# EAGLE design Sparkfun_LilyPad-Switched-Battery_SVOP (EAGLE 7.5.0)
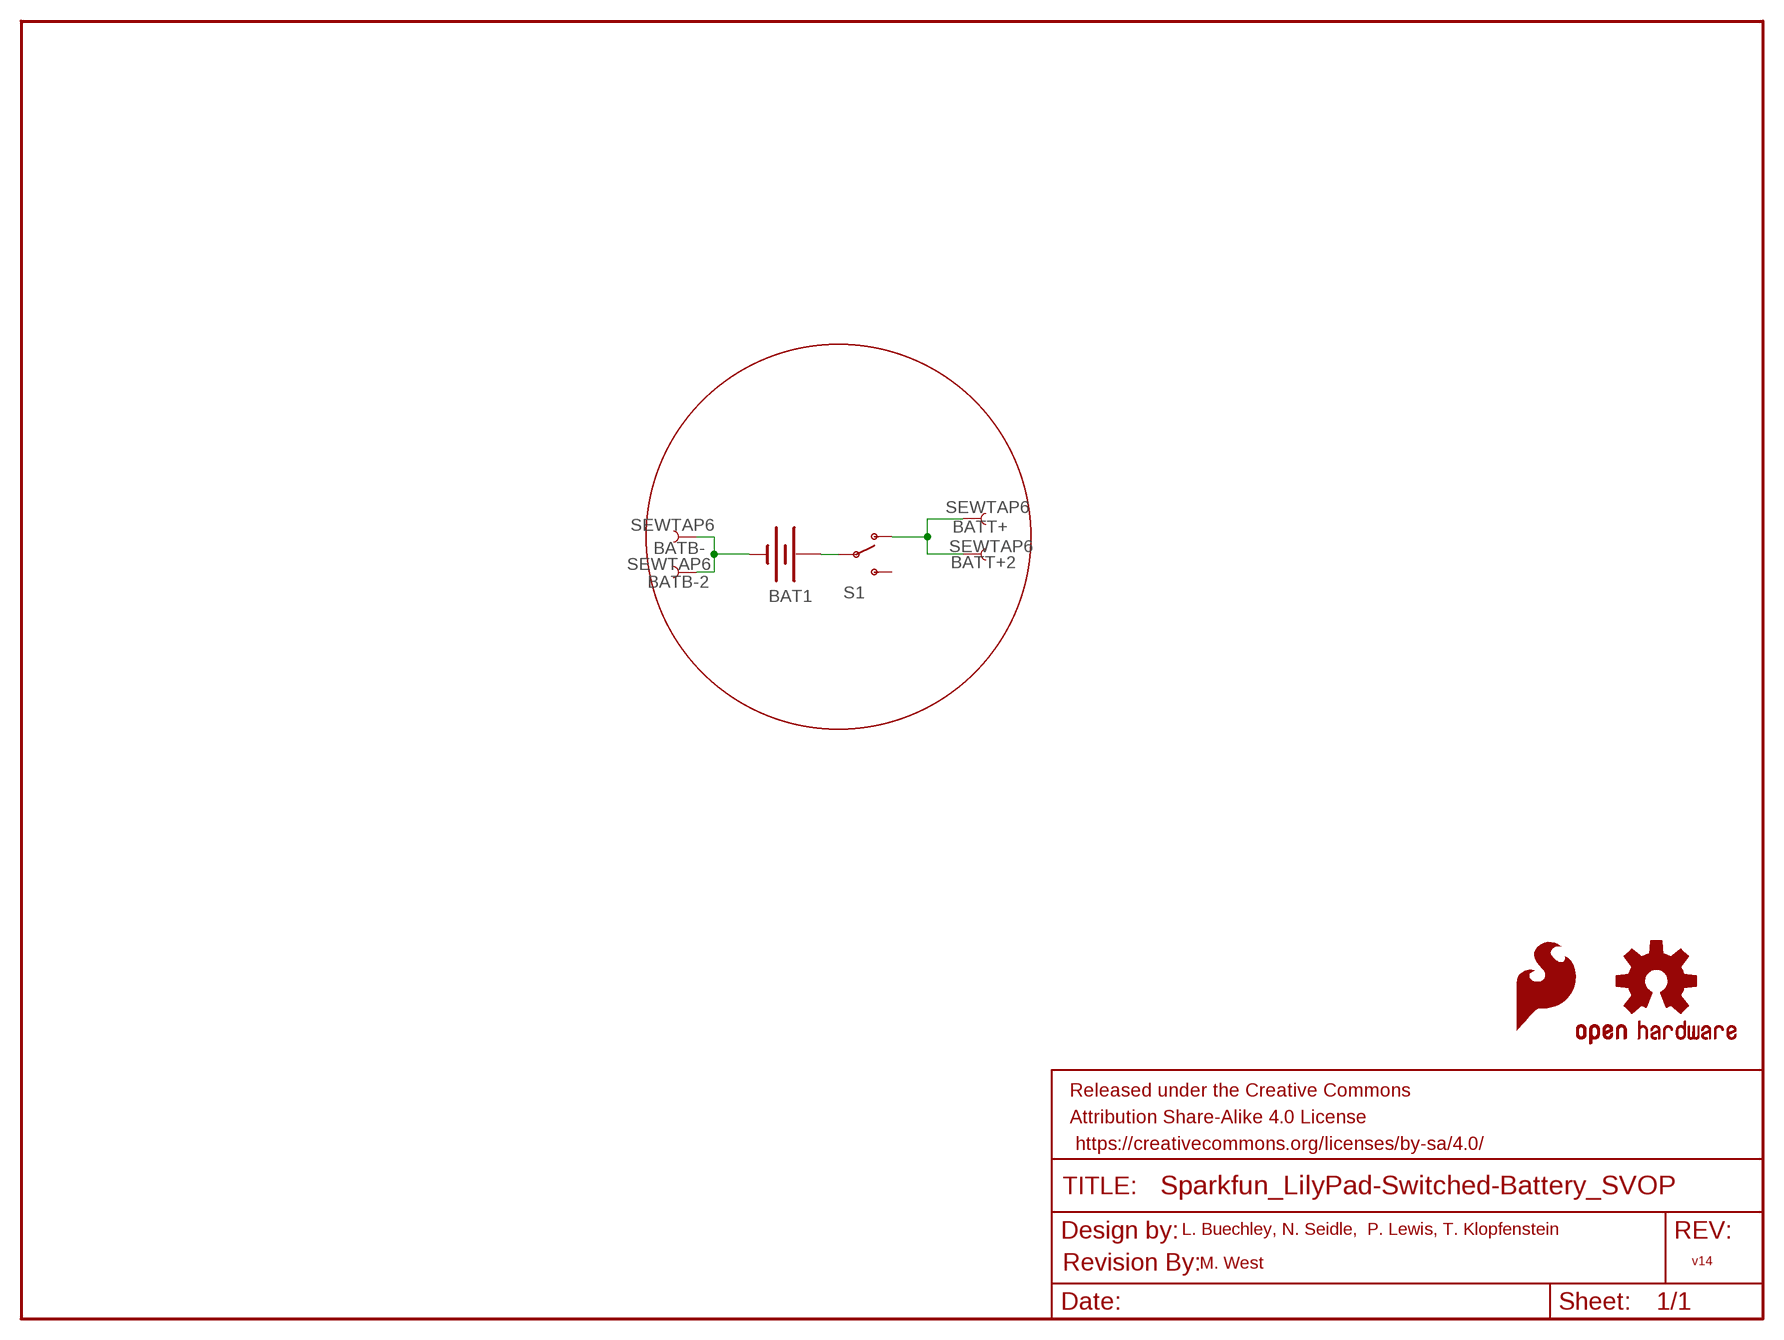
[diagram p0: schematic, sheet 1]

## Parts
BAT1  20mm coincell  BATTERY20MM_4LEGS  [BATTCON_20MM_4LEGS]
BATB-  SEWTAP6  [PETAL-SMALL-2SIDE]
BATB-2  SEWTAP6  [PETAL-SMALL-2SIDE]
BATT+  SEWTAP6  [PETAL-SMALL-2SIDE]
BATT+2  SEWTAP6  [PETAL-SMALL-2SIDE]
FRAME1  FRAME-LETTER  [CREATIVE_COMMONS]
LOGO1  SFE_LOGO_FLAME.1_INCH  [SFE_LOGO_FLAME_.1]
LOGO2  OSHW-LOGOS  [OSHW-LOGO-S]
S1  SWITCH-SPDTSMD  [AYZ0202]
U$1  REVISION  [REVISION]

## Nets
GND: BAT1.NEGATIVE(-) BATB-2.1 BATB-.1
N$1: BAT1.POSITIVE@1(+) BAT1.POSITIVE@2(+) BAT1.POSITIVE@3(+) BAT1.POSITIVE@4(+) S1.2(P)
N$2: BATT+2.1 BATT+.1 S1.1(O)
Unconnected: S1.3(S)

## Notes on the sheet
- L. Buechley, N. Seidle,  P. Lewis, T. Klopfenstein
- v14
- M. West

## Library data of the parts
BAT1 = SparkFun-Electromechanical:BATTERY: Battery Holders Various common sizes : AA, AAA, 18650 (PRT-12895), 20mm coin cell and 12mm coin cell. 20MM_4LEGS, BATT-10373; PROD_ID: BATT-10373
BATB- BATB-2 BATT+ BATT+2 = LilyPad-Wearables:SEWTAP: Sew Taps for LilyPad Boards.
FRAME1 = SparkFun-Aesthetics:FRAME-LETTER: Schematic Frame Standard 8.5x11 US Letter frame
LOGO1 = SparkFun-Aesthetics:SFE_LOGO_FLAME: SFE Logo, flame only This is the SparkFun flame logo. The logo on the schematic will always be the same size; the package variant is the height of the flame. Default layer for the logo on the board is tSilk.
LOGO2 = SparkFun-Aesthetics:OSHW-LOGO: Open Source Hardware Logo This logo indicates the piece of hardware it is found on incorporates a OSHW license and/or adheres to the definition of open source hardware found here: http://freedomdefined.org/OSHW
S1 = SparkFun-Electromechanical:SWITCH-SPDT: SPDT Switch Simple slide switch, Spark Fun Electronics SKU : COM-00102 DPDT SMT slide switch, AYZ0202, SWCH-08179; PROD_ID: SWCH-08179; SF_ID: COM-00597
U$1 = SparkFun-Aesthetics:REVISION

## Net classes
1 VCC: width 0.203 mm

## Board
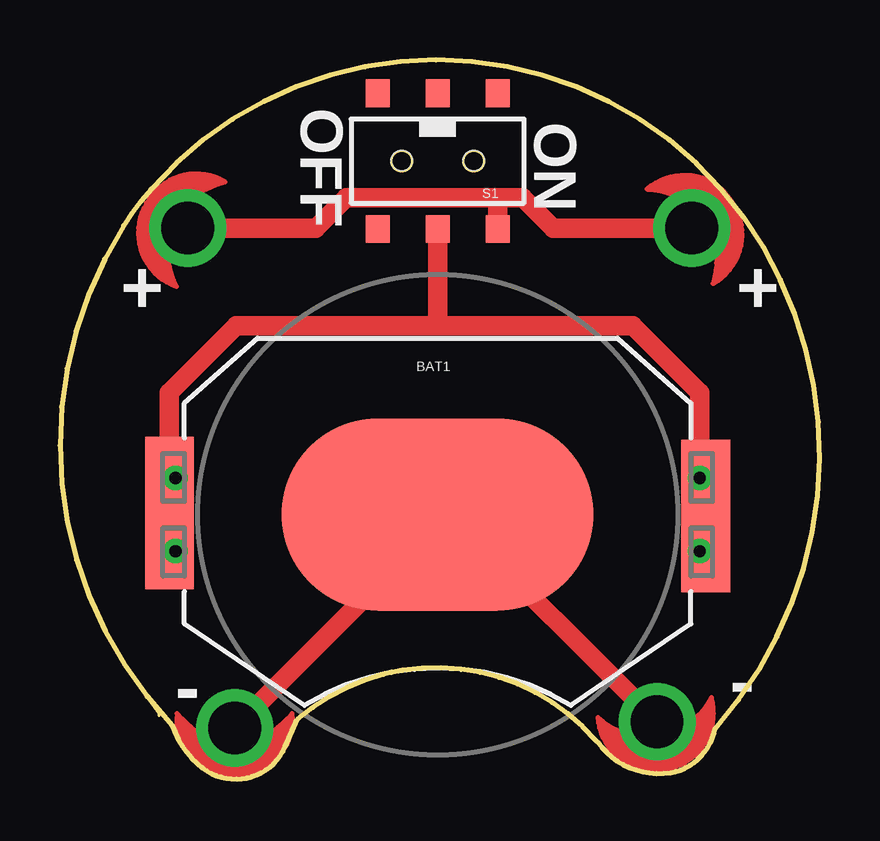
[diagram p1: board, top side]
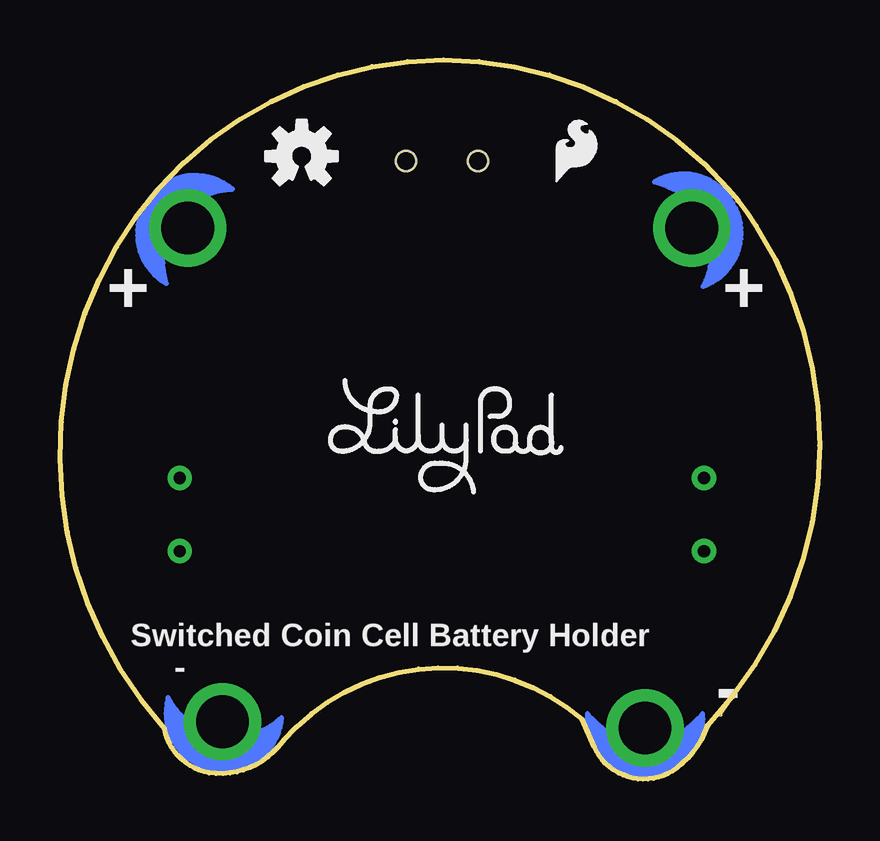
[diagram p2: board, bottom side, seen from below]

Size 31.65 x 29.99 mm. Coordinates in mm from the lower left corner, seen from the top.
Outline: 5.96,0.48 arc103 9.39,1.37
Outline: 5.99,0.52 arc180 5.93,0.44
Outline: 9.43,1.35 arc180 9.34,1.39 arc-180 9.43,1.35
Outline: 25.43,0.29 arc-63 22.4,1.57 arc63 25.43,0.29
Outline: 9.43,1.35 arc-180 9.34,1.39 arc180 9.43,1.35
Outline: 9.89,2.51 arc-90 22.34,1.62 arc90 9.89,2.51
Outline: 29.3,22.2 arc108 3.8,24.61
Outline: 29.26,22.17 arc180 29.34,22.22
Outline: 3.76,24.64 arc180 3.84,24.57
Outline: 25.43,0.29 arc70 27.29,2.13
Outline: 27.29,2.13 arc72 29.3,22.2
Outline: 29.34,22.22 arc180 29.26,22.17
Outline: 3.8,24.61 arc9 2.65,23.08
Outline: 3.84,24.57 arc180 3.76,24.64
Outline: 2.61,23.11 arc180 2.7,23.06
Outline: 2.65,23.08 arc76 4.69,2.26
Outline: 2.7,23.06 arc180 2.61,23.11
Outline: 4.69,2.26 arc35 5.96,0.48
Outline: 5.93,0.44 arc180 5.99,0.52
Outline: 5.96,0.48 arc103 9.39,1.37
Outline: 5.99,0.52 arc180 5.93,0.44
Outline: 25.44,0.24 arc180 25.42,0.34
Outline: 9.39,1.37 9.89,2.51
Outline: 29.3,22.2 arc108 3.8,24.61
Outline: 29.26,22.17 arc180 29.34,22.22
Outline: 3.76,24.64 arc180 3.84,24.57
Outline: 25.43,0.29 arc70 27.29,2.13
Outline: 25.42,0.34 arc180 25.44,0.24
Outline: 27.29,2.13 arc72 29.3,22.2
Outline: 29.34,22.22 arc180 29.26,22.17
Outline: 3.8,24.61 arc9 2.65,23.08
Outline: 3.84,24.57 arc180 3.76,24.64
Outline: 2.61,23.11 arc180 2.7,23.06
Outline: 2.65,23.08 arc76 4.69,2.26
Outline: 2.7,23.06 arc180 2.61,23.11
Outline: 4.69,2.26 arc35 5.96,0.48
Outline: 5.93,0.44 arc180 5.99,0.52
Outline: 3.62,3.4 4.13,2.69
Outline: 22.44,1.6 arc180 22.36,1.54 arc-180 22.44,1.6
Outline: 9.94,2.49 arc180 9.85,2.53 arc-180 9.94,2.49
Outline: 22.3,1.59 arc180 22.38,1.65 arc-180 22.3,1.59
Outline: 9.86,2.55 arc180 9.93,2.47 arc-180 9.86,2.55
Outline: 27.34,2.12 arc180 27.24,2.14 arc-180 27.34,2.12
Outline: 27.25,2.16 arc180 27.33,2.1 arc-180 27.25,2.16
Outline: 4.65,2.22 arc180 4.72,2.29 arc-180 4.65,2.22
Outline: 4.73,2.27 arc180 4.64,2.24 arc-180 4.73,2.27
Outline: 28.72,23.16 arc180 28.81,23.11 arc-180 28.72,23.16
Outline: 6.84,0 arc180 6.75,0.04 arc-180 6.84,0
Outline: 4.09,2.66 arc180 4.17,2.72 arc-180 4.09,2.66
Outline: 3.66,3.43 arc180 3.58,3.37 arc-180 3.66,3.43
Outline: 4.18,2.7 arc180 4.08,2.67 arc-180 4.18,2.7
Outline: circle at 14.24,25.75 radius 0.42
Outline: circle at 17.24,25.75 radius 0.42
Outline: circle at 14.24,25.75 radius 0.42
Outline: circle at 17.24,25.75 radius 0.42
Copper layers (1*16): Top 0.035mm / dielectric 1.5mm / Bottom 0.035mm
Design rules "SparkFun-2-layer-STANDARD *": minimum track width 10mil, minimum drill 20mil, track to track 10mil, track to pad 8mil, pad to pad 8mil, via to via 10mil, smd to smd 8mil, copper to edge 8mil, drill to drill 8mil, minimum pad ring 10mil, minimum via ring 10mil, stop-mask expansion 4mil, vias tented up to drill 25mil, thermal gap 10mil

### Footprints (pad centres in the part's own frame; a part is rotated, then mirrored left to right if it is on the bottom)
BATTCON_20MM_4LEGS = smd 13 x 8: NEGATIVE 0,0 | smd 2.032 x 3.175: POSITIVE@1 -11.176,1.651; POSITIVE@2 -11.176,-1.524; POSITIVE@3 11.176,1.524; POSITIVE@4 11.176,-1.651
PETAL-SMALL-2SIDE = drill 2.2: 1 0,0
AYZ0202 = smd 1 x 1.15: 1 -2.5,2.825; 2 0,2.825; 3 2.5,2.825; 4 -2.5,-2.825; 5 0,-2.825; 6 2.5,-2.825 | hole 0.85: 1.5,0; -1.5,0

### Placement (x,y rotation side)
BAT1  15.74,11.04 0 top
BATB-  7.28,2.15 0 top
BATB-2  24.88,2.41 10 top
BATT+  5.32,22.98 245 top
BATT+2  26.33,22.98 125 top
FRAME1  -9.23,-9.68 0 top  (outside the outline)
LOGO1  11.29,24.56 0 bottom
LOGO2  21.58,25.98 0 bottom
S1  15.74,25.78 180 top
U$1  2.16,-12.26 0 top  (outside the outline)
U$3  [LOGO-LILYPAD]  15.53,14.65 0 bottom

### Tracks (layer width: path | path; a pad name or v marks a point on that pad's centre or on a via)
GND
  Top 0.813: BATB-2.1 16.24,11.04 BAT1.NEGATIVE 15.74,10.61 BATB-.1
N$1  (via drill 0.51)
  Top 0.254: BAT1.POSITIVE@3 v26.66,12.57
  Top 0.813: 15.74,18.92 7.35,18.92 4.56,16.12 BAT1.POSITIVE@1 | 15.74,18.92 23.86,18.92 26.66,16.12 v26.66,12.57 BAT1.POSITIVE@4 v26.66,9.52 | BAT1.POSITIVE@1 v4.81,12.57 v4.81,9.52 BAT1.POSITIVE@2 | S1.2 15.74,18.92 | BAT1.POSITIVE@1 4.56,12.31 4.31,12.06 4.31,12.44 BAT1.POSITIVE@1
N$2
  Top 0.813: BATT+.1 10.66,22.98 11.93,24.25 18.28,24.25 | 18.28,24.25 19.29,24.25 20.56,22.98 BATT+2.1 | S1.1 18.24,24.21 18.28,24.25

### Text on the board
tPlace: OFF | ON | + | + | - | -
bPlace: + | + | - | - | Switched Coin Cell Battery Holder
Measures: All Units Inches
tDocu: Board Thickness: "0.032" | L. Buechley, N. Seidle, P. Lewis, T. Klopfenstein | M. West